# EasyEDA Pro project 24vStabilivolt_2025-04-15.eprj

# Schematic Schematic1
Board Name: Board1; Create Date: 2025-04-15; Page Name: P1; Project Name: 24vStabilivolt_2025-04-15; Schematic Name: Schematic1; Update Date: 2025-04-18; Company: 嘉立创EDA; Drawed: 王大智; Page Size: A4; Version: V1.0
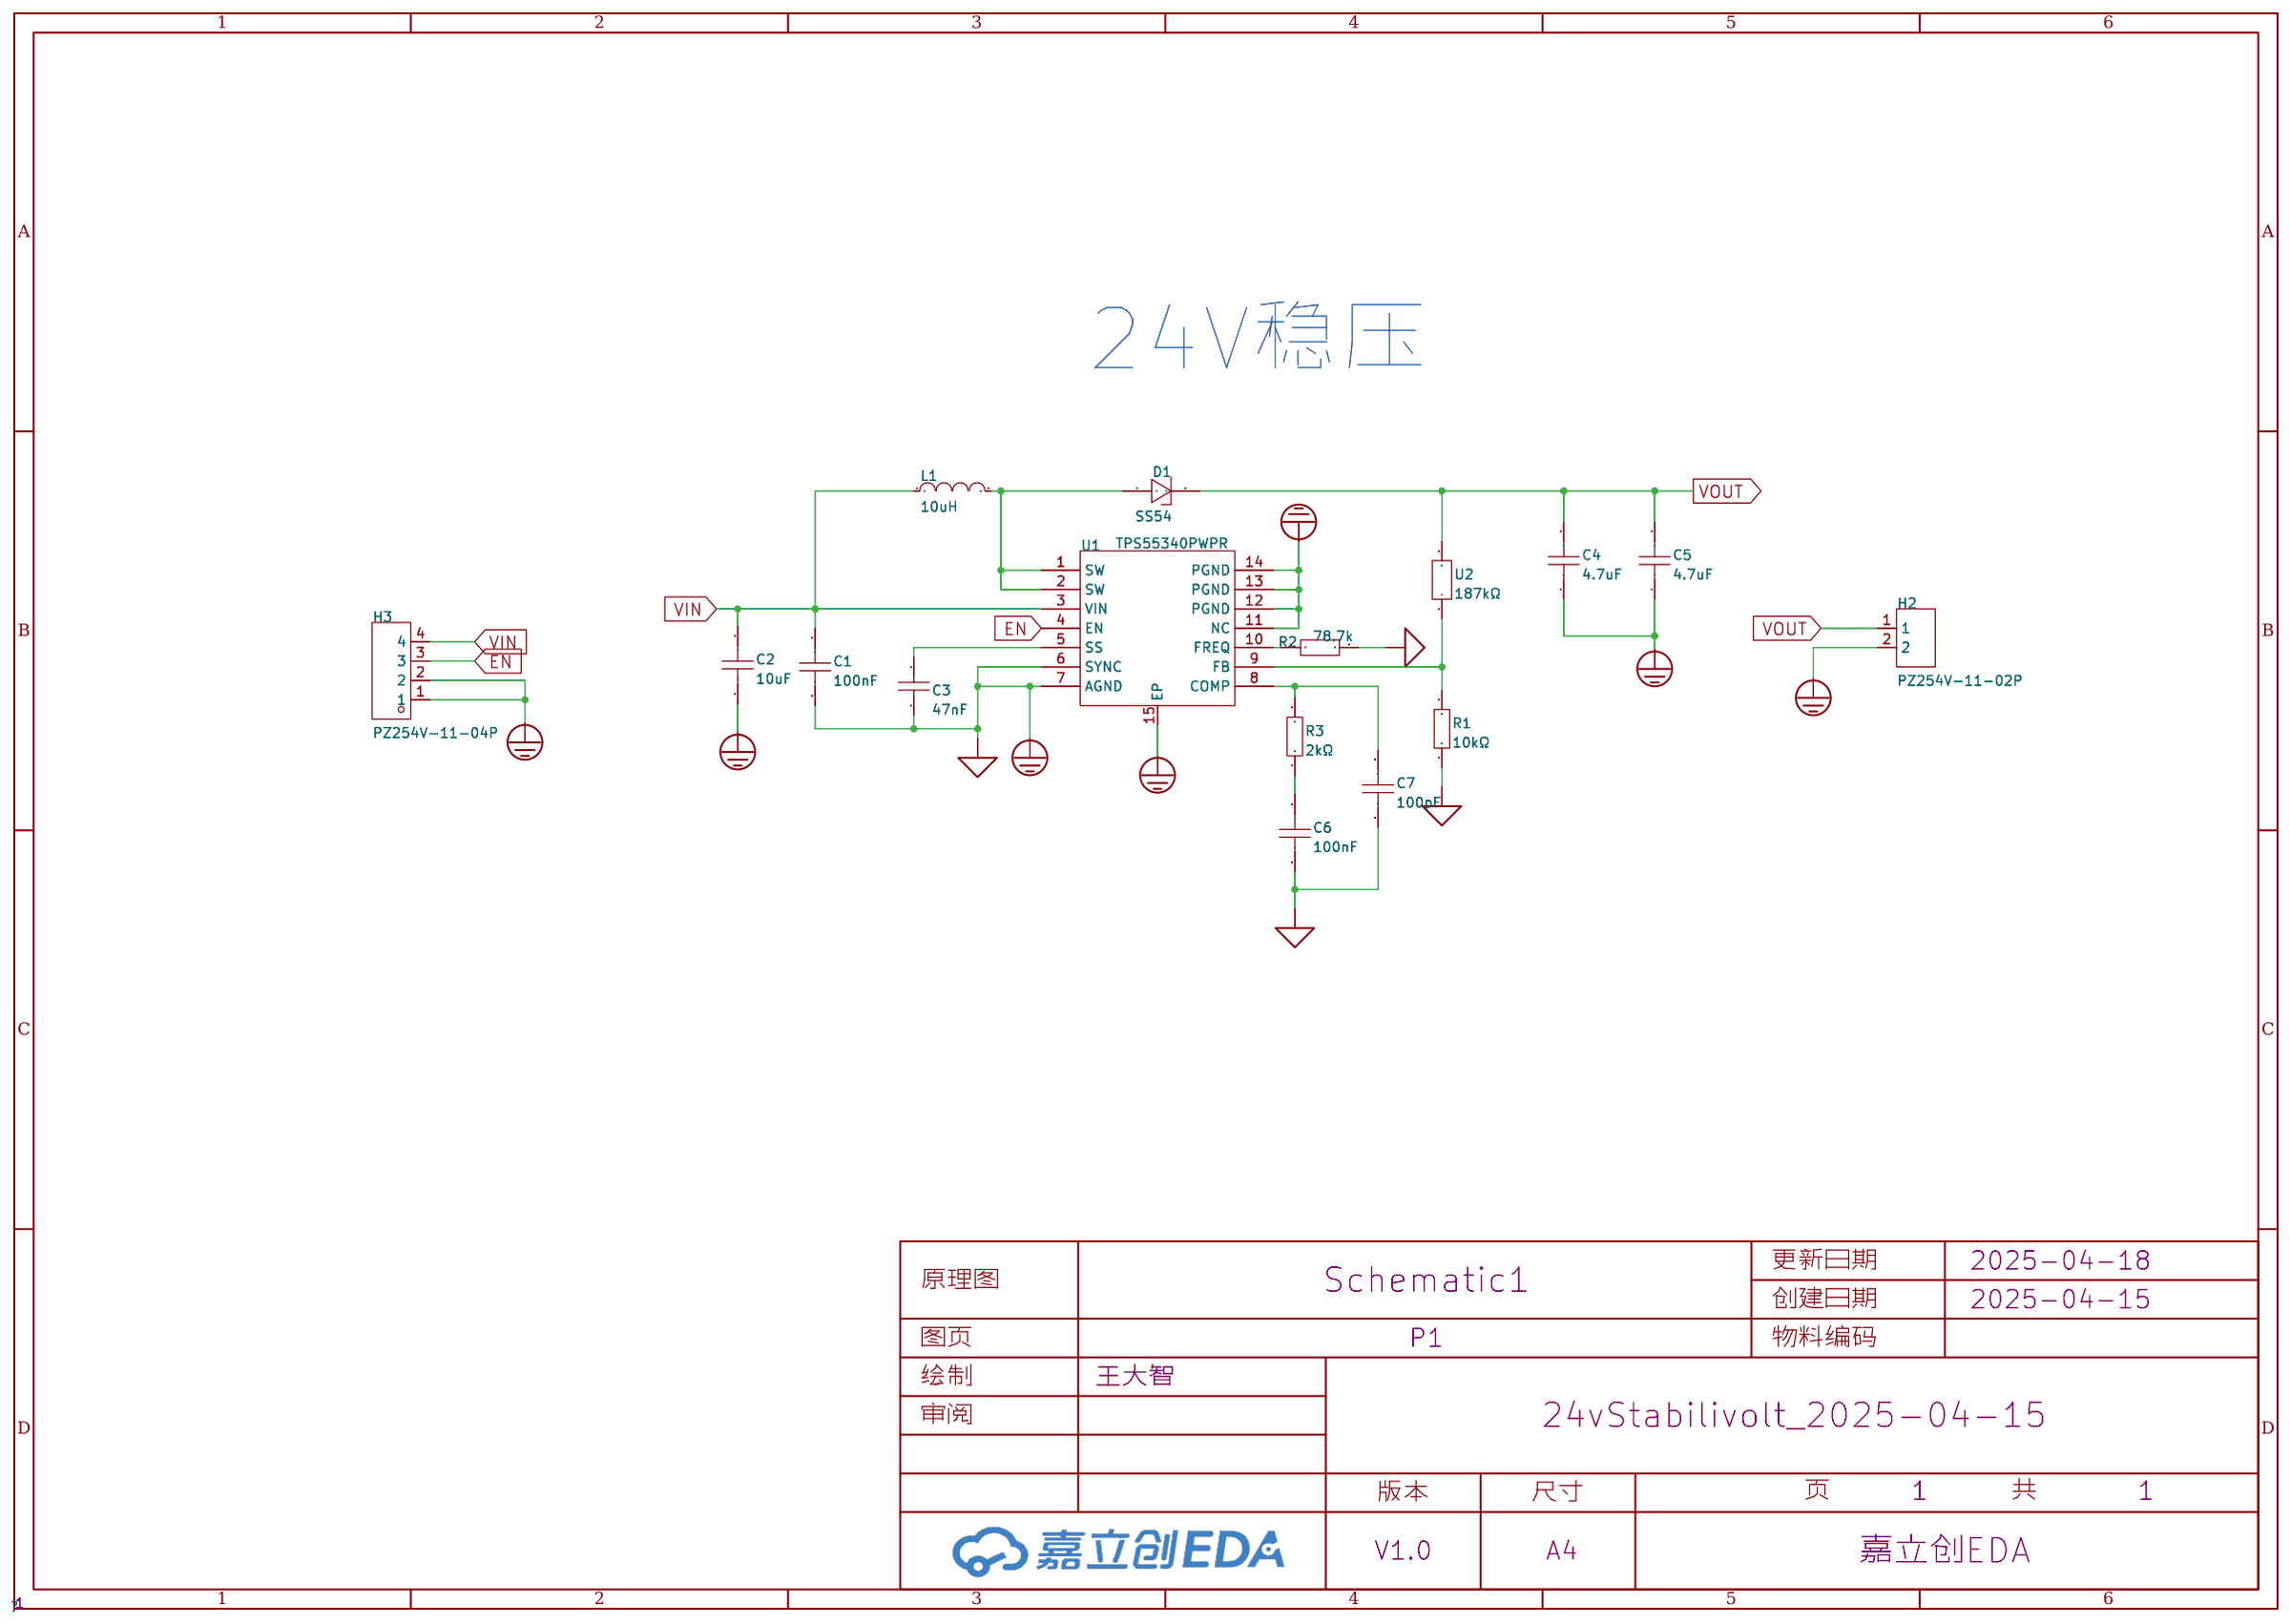
[diagram p0: schematic sheet]

## Parts
C1  100nF  [C0603]
C2  10uF  [C0805]
C3  47nF  [C0603]
C4  4.7uF  [C0805]
C5  4.7uF  [C0805]
C6  100nF  [C0603]
C7  100pF  [C0603]
D1  SS54  [SMA_L4.3-W2.6-LS5.0-FD]
H2  PZ254V-11-02P  [HDR-TH_2P-P2.54-V-M]
H3  PZ254V-11-04P  [HDR-TH_4P-P2.54-V-M]
L1  10uH  [IND-SMD_L7.3-W6.8]
R1  10kΩ  [R0603]
R2  78.7k  [R0603]
R3  2kΩ  [R0603]
U1  TPS55340PWPR  [HTSSOP-14_L5.0-W4.4-P0.65-LS6.4-BL-EP]
U2  187kΩ  [R0603]

## Library data of the parts
C1 = CAP_0603: Supplier Footprint: 0603
C2 = CGA0805X5R106K350MT: LCSC Part Name: 10uF ±10% 35V; Supplier Part: C6119888; Manufacturer: HRE(芯声); Supplier Footprint: 0805; JLCPCB Part Class: 扩展库; Datasheet: https://atta.szlcsc.com/upload/public/pdf/source/20250103/7EE7776C5D039D8AF646A3DBD9E7F50D.pdf; Supplier: LCSC; Tolerance: ±10%; Voltage Rating: 35V; Temperature Coefficient: X5R
C3 = CL10B473KB8NNNC: LCSC Part Name: 47nF ±10% 50V; Supplier Part: C1622; Manufacturer: SAMSUNG(三星); Supplier Footprint: 0603; JLCPCB Part Class: 基础库; Datasheet: https://atta.szlcsc.com/upload/public/pdf/source/20160218/1457707763339.pdf; Supplier: LCSC; Tolerance: ±10%; Voltage Rated: 50V; Temperature Coefficient: X7R
C4 C5 = CGA0805X7R475K350MT: LCSC Part Name: 4.7uF ±10% 35V; Supplier Part: C6119943; Manufacturer: HRE(芯声); Supplier Footprint: 0805; JLCPCB Part Class: 扩展库; Supplier: LCSC; Tolerance: ±10%; Voltage Rated: 35V; Temperature Coefficient: X7R
C6 = CGA0603X7R104K500JT: LCSC Part Name: 100nF ±10% 50V; Supplier Part: C6119867; Manufacturer: HRE(芯声); Supplier Footprint: 0603; JLCPCB Part Class: 扩展库; Datasheet: https://atta.szlcsc.com/upload/public/pdf/source/20250103/C44077DA9E7B3EFAE02F22B6D3D1CBC9.pdf; Supplier: LCSC; Tolerance: ±10%; Voltage Rating: 50V; Temperature Coefficient: X7R
C7 = CC0603JRNPO9BN101: LCSC Part Name: 100pF ±5% 50V; Supplier Part: C14665; Manufacturer: YAGEO(国巨); Supplier Footprint: 0603; JLCPCB Part Class: 扩展库; Datasheet: https://atta.szlcsc.com/upload/public/pdf/source/20181008/C309499_21CC21451B82C39E3D92150FD6B30293.pdf; Supplier: LCSC; Tolerance: ±5%; Voltage Rated: 50V; Temperature Coefficient: NP0
D1 = SS54_C7420369: LCSC Part Name: 电压:40V 电流:5A; Supplier Part: C7420369; Manufacturer: 宏迦橙; Supplier Footprint: SMA(DO-214AC); JLCPCB Part Class: 扩展库; Datasheet: https://atta.szlcsc.com/upload/public/pdf/source/20230828/254C3882F8647358AD9F60DD73611B5E.pdf; Supplier: LCSC; Diode Configuration: 独立式; Forward Voltage (Vf@If): 550mV@5.0A; Reverse Voltage (Vr): 40V; Rectified Current: 5A; Reverse Leakage Current (Ir): 50uA@40V
H2 = PZ254V-11-02P: LCSC Part Name: 1x2P 间距:2.54mm 方针 直插; Supplier Part: C492401; Manufacturer: XFCN(兴飞); Supplier Footprint: 插件,P=2.54mm; JLCPCB Part Class: 扩展库; Datasheet: https://atta.szlcsc.com/upload/public/pdf/source/20200309/C492401_A812433581A9B211A7FFA413ADDFF0E5.pdf; Supplier: LCSC; Pin Structure: 1x2P; Pitch: 2.54mm; Circluar Pins/Square Pins: 方针; Mounting Type: 直插; Number of Rows: 单排; Number of Pins: 2P; Length of Mating Pin: 6mm; Insulation Height: 2.5mm; Length of End Connection Pin: 3mm; Contact Material: 黄铜; Operating Temperature: -40℃~+105℃; Color: 黑色
H3 = PZ254V-11-04P: LCSC Part Name: 间距:2.54mm 1x4P 直插 方针; Supplier Part: C2691448; Manufacturer: XFCN(兴飞); Supplier Footprint: 插件,P=2.54mm; JLCPCB Part Class: 扩展库; Datasheet: https://atta.szlcsc.com/upload/public/pdf/source/20200309/C492403_F9F19131791D08044AD4F84F8E751A34.pdf; Supplier: LCSC; Pin Structure: 1x4P; Pitch: 2.54mm; Circluar Pins/Square Pins: 方针; Mounting Type: 直插; Number of Rows: 单排; Number of Pins: 4P; Current Rating (Max): 3A; Voltage Rating (Max): 250V; Length of Mating Pin: 6mm; Insulation Height: 2.5mm; Length of End Connection Pin: 3mm; Operating Temperature Range: -40℃~+105℃; Color: 黑色
L1 = FXL0630-100-M: LCSC Part Name: 10uH ±20% 5.5A; Supplier Part: C167223; Manufacturer: cjiang(长江微电); Supplier Footprint: SMD,6.6x7mm; JLCPCB Part Class: 扩展库; Datasheet: https://atta.szlcsc.com/upload/public/pdf/source/20240426/3189EA8206330E2108542F9E34E540E7.pdf; Supplier: LCSC; Tolerance: ±20%; Rated Current: 4.5A; Saturation Current (Isat): 5.5A; DC Resistance (DCR): 68mΩ; Type: 一体成型电感
R1 = RC0603FR-0710KL: LCSC Part Name: 厚膜电阻 10kΩ ±1% 100mW; Supplier Part: C98220; Manufacturer: YAGEO(国巨); Supplier Footprint: 0603; JLCPCB Part Class: 扩展库; Datasheet: https://atta.szlcsc.com/upload/public/pdf/source/20180927/C295883_E8D83085EA81BD7DE0B2B681138C15EE.pdf; Supplier: LCSC; Type: 厚膜电阻; Tolerance: ±1%; Power(Watts): 100mW; Overload Voltage (Max): 75V; Temperature Coefficient: ±100ppm/℃; Operating Temperature Range: -55℃~+155℃
R2 = Res_0603: Supplier Footprint: 0603
R3 = 0603WAF2001T5E: LCSC Part Name: 2kΩ ±1% 100mW 厚膜电阻; Supplier Part: C22975; Manufacturer: UNI-ROYAL(厚声); Supplier Footprint: 0603; JLCPCB Part Class: 基础库; Datasheet: https://atta.szlcsc.com/upload/public/pdf/source/20200306/C422600_1E6D84923E4A46A82E41ADD87F860B5C.pdf; Supplier: LCSC; Type: 厚膜电阻; Tolerance: ±1%; Power(Watts): 100mW; Overload Voltage (Max): 75V; Temperature Coefficient: ±100ppm/℃; Operating Temperature Range: -55℃~+155℃
U1 = TPS55340PWPR: LCSC Part Name: 5-A, 40-V 非同步开关调节器; Supplier Part: C43862; Manufacturer: TI(德州仪器); Supplier Footprint: HTSSOP-14-EP; JLCPCB Part Class: 扩展库; Datasheet: https://www.ti.com/cn/lit/gpn/tps55340; Supplier: LCSC; Function: 升压型; Output Type: 固定; Input Voltage: 2.9V~32V; Output Voltage: 24V; Output Current: 5.25A; Switching Frequency: 100kHz~1.2MHz; Operating Temperature: -40℃~+150℃; Synchronous Rectification: 否; Number of Outputs: 1; Topology: 升压式；SEPIC；反激式; Switch tube (built-in/external): 内置
U2 = FRC0603F1873TS: LCSC Part Name: 187kΩ ±1% 100mW 厚膜电阻; Supplier Part: C3000717; Manufacturer: FOJAN(富捷); Supplier Footprint: 0603; JLCPCB Part Class: 扩展库; Datasheet: https://atta.szlcsc.com/upload/public/pdf/source/20211221/925EC7D7225764EE0046F22065062C87.pdf; Supplier: LCSC; Type: 厚膜电阻; Tolerance: ±1%; Power(Watts): 100mW; Overload Voltage (Max): 75V; Temperature Coefficient: ±100ppm/℃

## Nets
AGND: C6.1 C7.1 R1.1 R2.2
PGND: C1.1 C2.1 C3.1 C4.1 C5.1 H2.2 H3.1 H3.2 U1.6(SYNC) U1.7(AGND) U1.11(NC) U1.12(PGND) U1.13(PGND) U1.14(PGND) U1.15(EP)
VIN: C1.2 C2.2 H3.4 L1.1 U1.3(VIN)
EN: H3.3 U1.4(EN)
VOUT: C4.2 C5.2 D1.2(K) H2.1 U2.2
$1N560: R2.1 U1.10(FREQ)
$1N579: R1.2 U1.9(FB) U2.1
$1N1024: D1.1(A) L1.2 U1.1(SW) U1.2(SW)
$1N1284: C3.2 U1.5(SS)
$1N2148: C7.2 R3.2 U1.8(COMP)
$1N2196: C6.2 R3.1

## Notes on the sheet
- 24V稳压

# Board PCB1
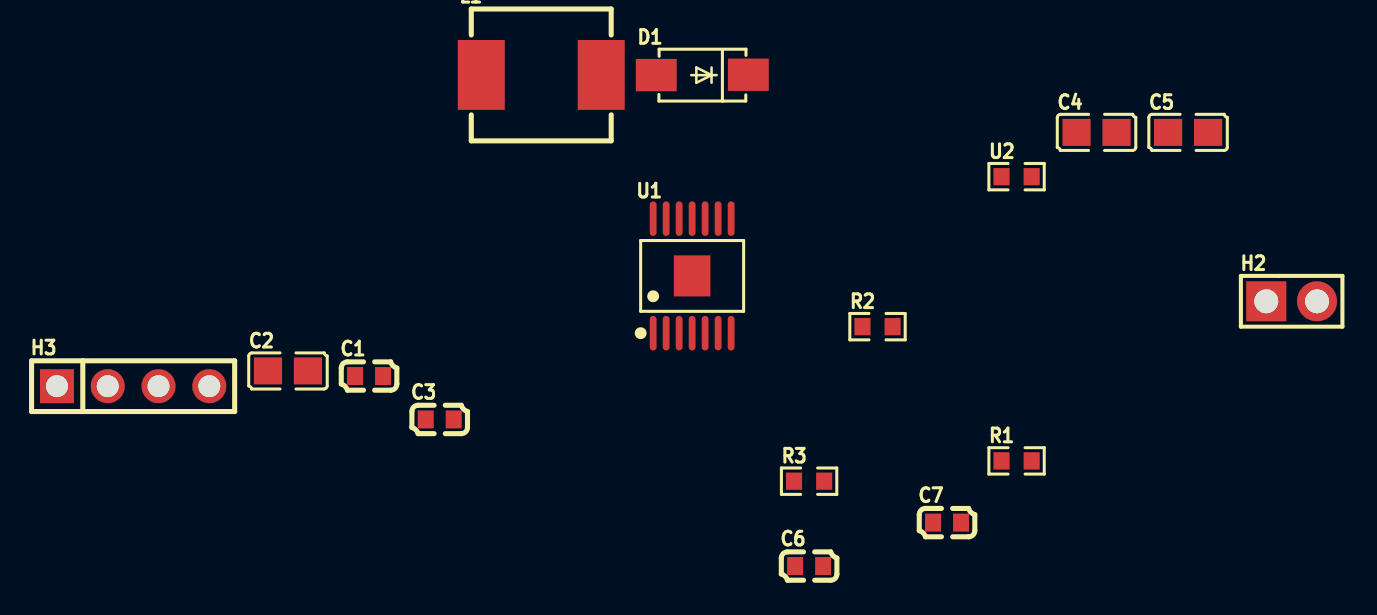
[diagram p1: board, top side]
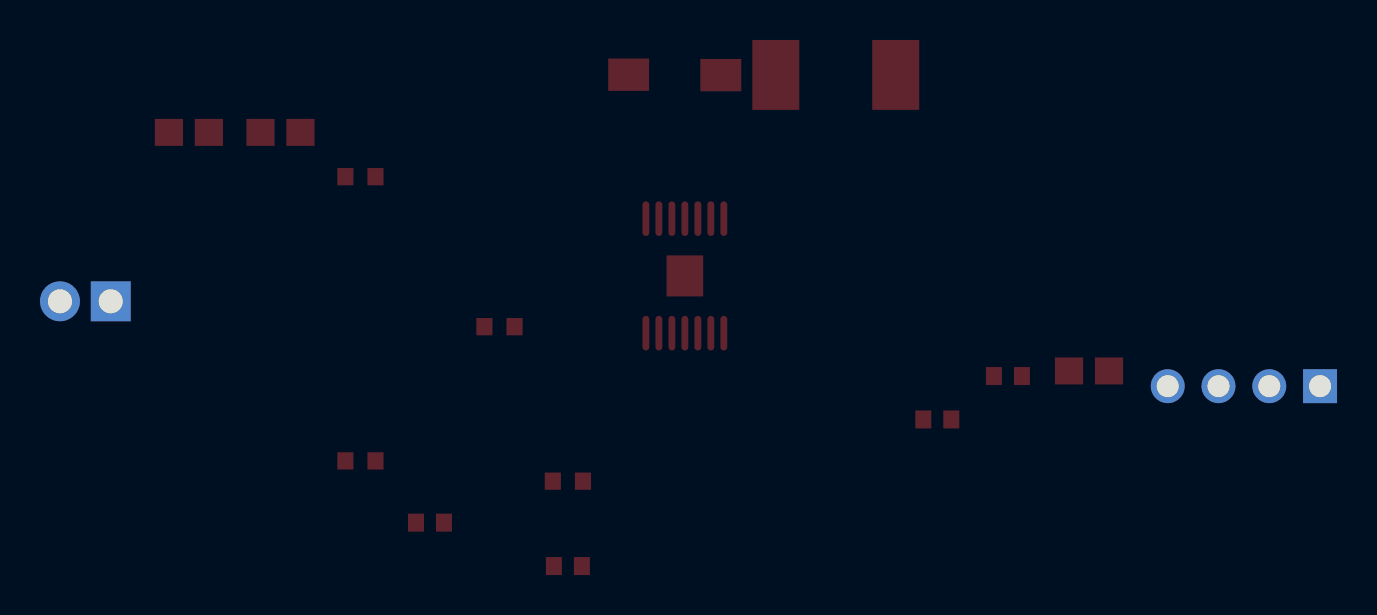
[diagram p2: board, bottom side, seen from below]

No outline. copper layers: Top Layer, Bottom Layer. Coordinates in mm from the lowest, leftmost part position.
Stack: Top Layer 0.035mm / Dielectric1 1.51mm FR4 er 4.5 / Bottom Layer 0.035mm

## Design rules (mm)
template: JLCPCB Capability(Two Layers Board)
spacing copperThickness1oz (default): track to track 0.102, other pairs 0.152 to 0.3
spacing copperThickness2oz: track to track 0.203, other pairs 0.152 to 0.3
track width copperThickness1oz (default): min 0.127, default 0.254, max 2.54
track width copperThickness2oz: min 0.203, default 0.254, max 2.54
differential pair differentialPair (default): width min 0.127, default 0.254, max 2.54; gap min 0.152, default 0.152
via viaSize (default): diameter min 0.5, default 0.61, max 10; hole min 0.3, default 0.305, max 6.3

## Placement (name value [footprint] x y rotation side)
C1  100nF  [C0603]  11.8 9.51 0 top
C2  10uF  [C0805]  7.75 9.77 0 top
C3  47nF  [C0603]  15.34 7.34 0 top
C4  4.7uF  [C0805]  48.2 21.71 0 top
C5  4.7uF  [C0805]  52.78 21.71 0 top
C6  100nF  [C0603]  33.82 0 0 top
C7  100pF  [C0603]  40.72 2.17 0 top
D1  SS54  [SMA_L4.3-W2.6-LS5.0-FD]  28.47 24.58 0 top
H2  PZ254V-11-02P  [HDR-TH_2P-P2.54-V-M]  57.96 13.25 0 top
H3  PZ254V-11-04P  [HDR-TH_4P-P2.54-V-M]  0 9 0 top
L1  10uH  [IND-SMD_L7.3-W6.8]  20.42 24.58 0 top
R1  10kΩ  [R0603]  44.2 5.26 0 top
R2  78.7k  [R0603]  37.24 11.98 0 top
R3  2kΩ  [R0603]  33.82 4.25 0 top
U1  TPS55340PWPR  [HTSSOP-14_L5.0-W4.4-P0.65-LS6.4-BL-EP]  27.97 14.52 0 top
U2  187kΩ  [R0603]  44.2 19.49 0 top

## Footprints (pads in the part's own frame, mm; a bottom-side part is the same pattern mirrored in y, then rotated)
C0603
  rect 0.8x0.9 smd: 1(-0.7,0) 2(0.7,0)
C0805
  rect 1.41x1.35 smd: 1(-1,0) 2(1,0)
HDR-TH_2P-P2.54-V-M
  rect 2x2 hole 1.2: 1(-1.27,0)
  round 2 hole 1.2: 2(1.27,0)
HDR-TH_4P-P2.54-V-M
  rect 1.7x1.7 hole 1.1: 1(-3.81,0)
  round 1.7 hole 1.1: 2(-1.27,0) 3(1.27,0) 4(3.81,0)
HTSSOP-14_L5.0-W4.4-P0.65-LS6.4-BL-EP
  oval 0.343x1.732 smd: 1(-1.95,-2.866) 2(-1.3,-2.866) 3(-0.65,-2.866) 4(0,-2.866) 5(0.65,-2.866) 6(1.3,-2.866) 7(1.95,-2.866) 8(1.95,2.866) 9(1.3,2.866) 10(0.65,2.866) 11(0,2.866) 12(-0.65,2.866) 13(-1.3,2.866) 14(-1.95,2.866)
  rect 1.83x2.055 smd: 15(0,0)
IND-SMD_L7.3-W6.8
  rect 2.35x3.5 smd: 1(-3,0) 2(3,0)
R0603
  rect 0.806x0.864 smd: 1(-0.753,0) 2(0.753,0)
SMA_L4.3-W2.6-LS5.0-FD
  rect 2.046x1.62 smd: 1(-2.304,-0.009) 2(2.304,0.009)

## Nets
As in the schematic.
